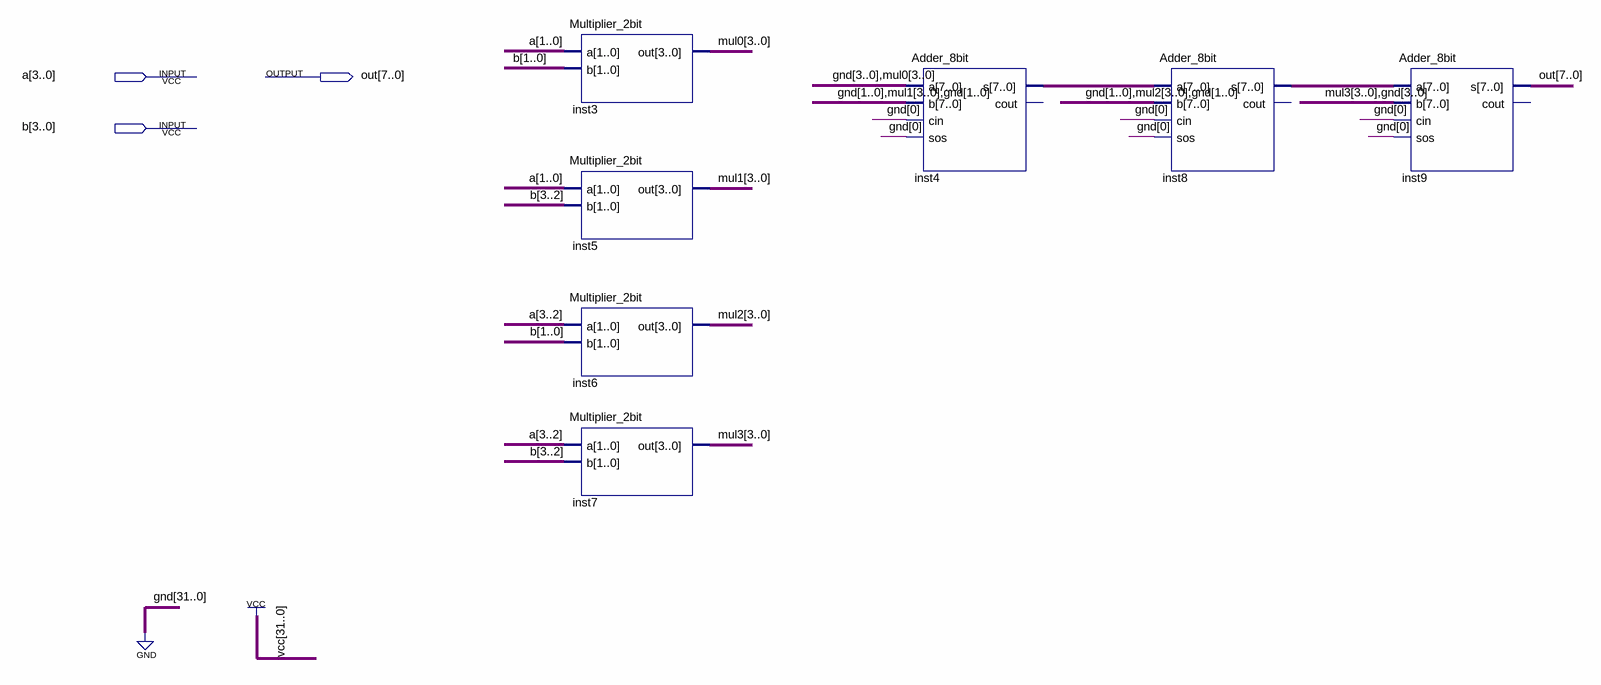
[diagram p0: schematic sheet]
// Quartus schematic Multiplier_4bit.bdf as structural Verilog: 7 symbols, 3 pins
module Multiplier_4bit (
  input  [3:0] a,
  input  [3:0] b,
  output [7:0] out
);

  wire [3:0] mul0, mul1, mul2, mul3;
  wire [7:0] inst4_s, inst8_s;

  Multiplier_2bit inst3 (.a(a[1:0]), .b(b[1:0]), .out(mul0));
  Multiplier_2bit inst5 (.a(a[1:0]), .b(b[3:2]), .out(mul1));
  Multiplier_2bit inst6 (.a(a[3:2]), .b(b[1:0]), .out(mul2));
  Multiplier_2bit inst7 (.a(a[3:2]), .b(b[3:2]), .out(mul3));
  Adder_8bit inst4 (.a({4'b0000, mul0}), .b({2'b00, mul1, 2'b00}), .cin(1'b0), .sos(1'b0), .s(inst4_s));  // open: cout
  Adder_8bit inst8 (.a(inst4_s), .b({2'b00, mul2, 2'b00}), .cin(1'b0), .sos(1'b0), .s(inst8_s));  // open: cout
  Adder_8bit inst9 (.a(inst8_s), .b({mul3, 4'b0000}), .cin(1'b0), .sos(1'b0), .s(out));  // open: cout
endmodule
